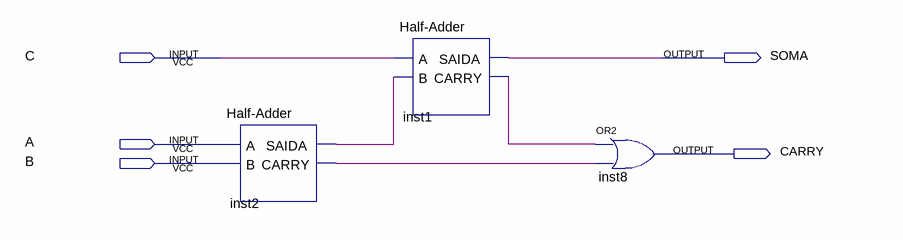
[diagram p0: schematic sheet]
// Quartus schematic Full-Adder.bdf as structural Verilog: 3 symbols, 5 pins
module \Full-Adder  (
  input  C,
  input  A,
  input  B,
  output SOMA,
  output CARRY
);

  wire inst1_carry, inst2_carry, inst2_saida;

  \Half-Adder  inst2 (.A(A), .B(B), .SAIDA(inst2_saida), .CARRY(inst2_carry));
  \Half-Adder  inst1 (.A(C), .B(inst2_saida), .SAIDA(SOMA), .CARRY(inst1_carry));
  or inst8 (CARRY, inst1_carry, inst2_carry);
endmodule
